# EAGLE design filters (EAGLE 6.5.0)
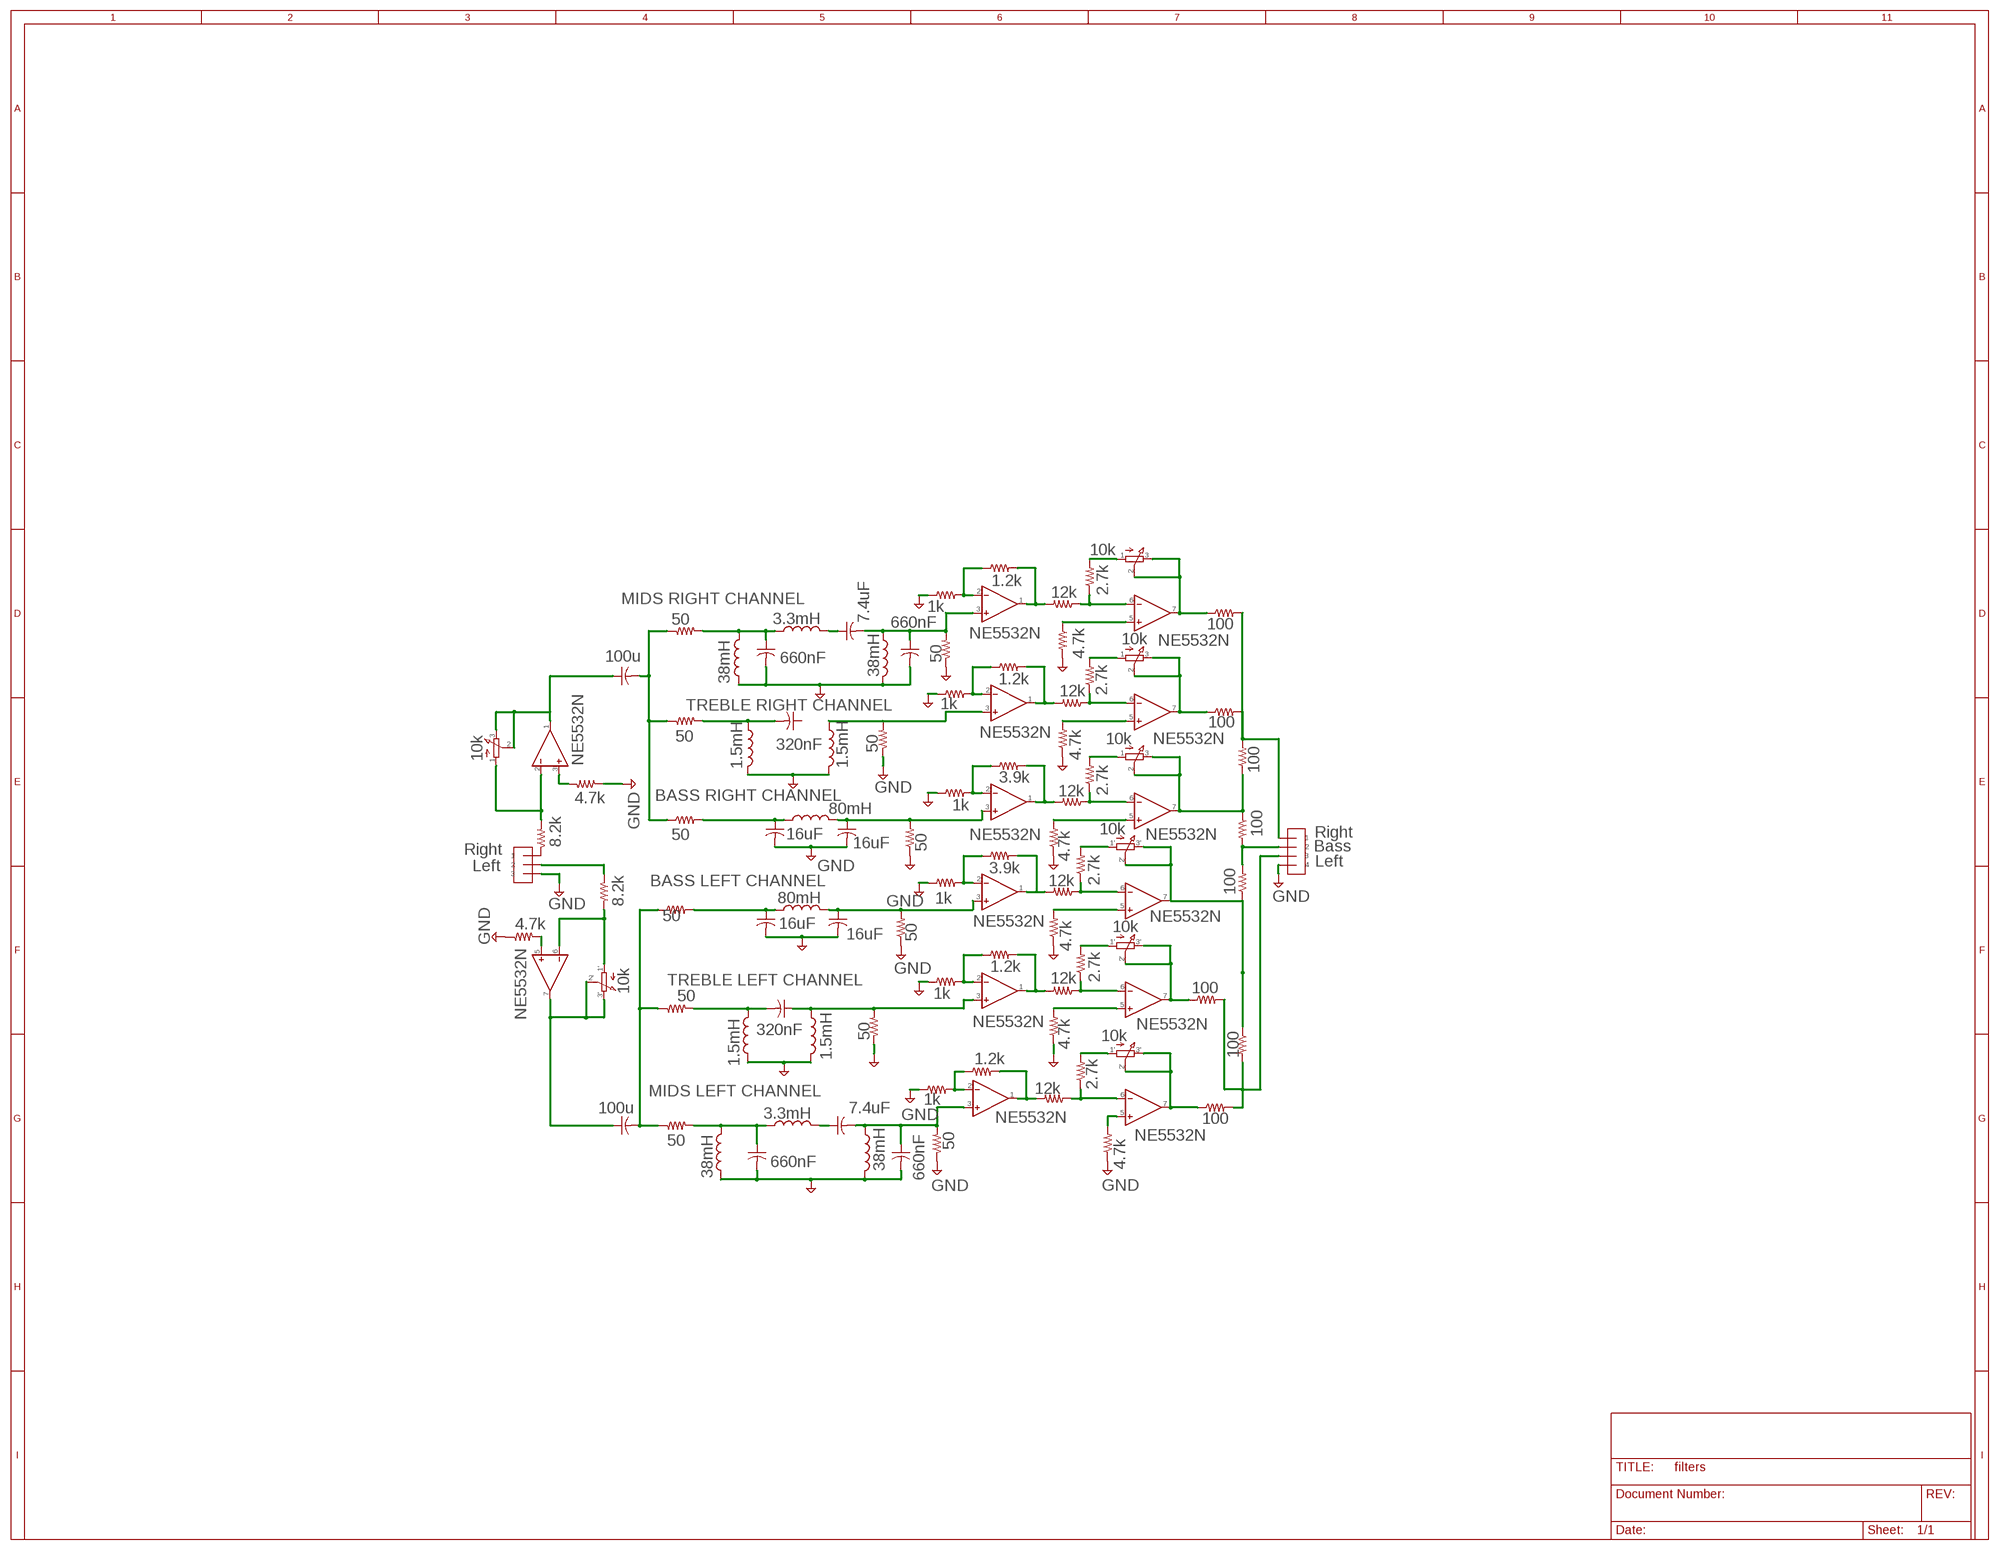
[diagram p0: schematic, sheet 1]

## Parts
C1  7.4uF  C-US050-024X044  [C050-024X044]
C2  660nF  C-US050-024X044  [C050-024X044]
C3  660nF  C-US050-024X044  [C050-024X044]
C4  320nF  C-US050-024X044  [C050-024X044]
C5  16uF  C-US050-024X044  [C050-024X044]
C6  16uF  C-US050-024X044  [C050-024X044]
C7  16uF  C-US050-024X044  [C050-024X044]
C8  16uF  C-US050-024X044  [C050-024X044]
C9  320nF  C-US050-024X044  [C050-024X044]
C10  7.4uF  C-US050-024X044  [C050-024X044]
C11  660nF  C-US050-024X044  [C050-024X044]
C12  660nF  C-US050-024X044  [C050-024X044]
C13  100u  C-US050-024X044  [C050-024X044]
C14  100u  C-US050-024X044  [C050-024X044]
IC1  NE5532N  [DIL08]
IC2  NE5532N  [DIL08]
IC3  NE5532N  [DIL08]
IC4  NE5532N  [DIL08]
IC5  NE5532N  [DIL08]
IC6  NE5532N  [DIL08]
IC7  NE5532N  [DIL08]
J1  3_PIN_AMPCONN  [3_PIN_AMPCONN]
J2  4_PIN_AMPCONN  [4_PIN_AMPCON]
L1  3.3mH  L-US6000-XXX-RC  [6000-XXXX-RC]
L2  38mH  L-US6000-XXX-RC  [6000-XXXX-RC]
L3  38mH  L-US6000-XXX-RC  [6000-XXXX-RC]
L4  1.5mH  L-US6000-XXX-RC  [6000-XXXX-RC]
L5  1.5mH  L-US6000-XXX-RC  [6000-XXXX-RC]
L6  80mH  L-US6000-XXX-RC  [6000-XXXX-RC]
L7  80mH  L-US6000-XXX-RC  [6000-XXXX-RC]
L8  1.5mH  L-US6000-XXX-RC  [6000-XXXX-RC]
L9  1.5mH  L-US6000-XXX-RC  [6000-XXXX-RC]
L10  3.3mH  L-US6000-XXX-RC  [6000-XXXX-RC]
L11  38mH  L-US6000-XXX-RC  [6000-XXXX-RC]
L12  38mH  L-US6000-XXX-RC  [6000-XXXX-RC]
R1  8.2k  R-US_0204/2V  [0204V]
R2  8.2k  R-US_0204/2V  [0204V]
R3  50  R-US_0204/2V  [0204V]
R4  50  R-US_0204/2V  [0204V]
R5  1k  R-US_0204/2V  [0204V]
R6  12k  R-US_0204/2V  [0204V]
R7  1k  R-US_0204/2V  [0204V]
R8  3.9k  R-US_0204/2V  [0204V]
R9  50  R-US_0204/2V  [0204V]
R10  50  R-US_0204/2V  [0204V]
R11  12k  R-US_0204/2V  [0204V]
R12  1.2k  R-US_0204/2V  [0204V]
R13  1k  R-US_0204/2V  [0204V]
R14  50  R-US_0204/2V  [0204V]
R15  50  R-US_0204/2V  [0204V]
R16  12k  R-US_0204/2V  [0204V]
R17  1.2k  R-US_0204/2V  [0204V]
R18  2.7k  R-US_0204/2V  [0204V]
R19  12k  R-US_0204/2V  [0204V]
R20  1k  R-US_0204/2V  [0204V]
R21  3.9k  R-US_0204/2V  [0204V]
R22  50  R-US_0204/2V  [0204V]
R23  50  R-US_0204/2V  [0204V]
R24  12k  R-US_0204/2V  [0204V]
R25  1.2k  R-US_0204/2V  [0204V]
R26  1k  R-US_0204/2V  [0204V]
R27  50  R-US_0204/2V  [0204V]
R28  50  R-US_0204/2V  [0204V]
R29  2.7k  R-US_0204/2V  [0204V]
R30  2.7k  R-US_0204/2V  [0204V]
R31  50  R-US_0204/2V  [0204V]
R32  50  R-US_0204/2V  [0204V]
R33  12k  R-US_0204/2V  [0204V]
R34  2.7k  R-US_0204/2V  [0204V]
R35  2.7k  R-US_0204/2V  [0204V]
R36  1.2k  R-US_0204/2V  [0204V]
R37  2.7k  R-US_0204/2V  [0204V]
R38  1k  R-US_0204/2V  [0204V]
R39  100  R-US_0204/2V  [0204V]
R40  100  R-US_0204/2V  [0204V]
R41  100  R-US_0204/2V  [0204V]
R42  4.7k  R-US_0204/2V  [0204V]
R43  4.7k  R-US_0204/2V  [0204V]
R44  4.7k  R-US_0204/2V  [0204V]
R45  4.7k  R-US_0204/2V  [0204V]
R46  4.7k  R-US_0204/2V  [0204V]
R47  4.7k  R-US_0204/2V  [0204V]
R48  4.7k  R-US_0204/2V  [0204V]
R49  4.7k  R-US_0204/2V  [0204V]
R88  100  R-US_0204/2V  [0204V]
R89  100  R-US_0204/2V  [0204V]
R90  100  R-US_0204/2V  [0204V]
R91  100  R-US_0204/2V  [0204V]
R92  100  R-US_0204/2V  [0204V]
VR1  10k  VOL_POT_2GANG  [VOL_POT_2GANG]
VR2  10k  P140KV1-F25BR  [TONE_POT_2GANG]
VR3  10k  P140KV1-F25BR  [TONE_POT_2GANG]
VR4  10k  P140KV1-F25BR  [TONE_POT_2GANG]

## Nets
BASS: J2.2 R41.2 R90.2
GND: C2.2 C3.2 C5.2 C6.2 C7.2 C8.2 C11.2 C12.2 J1.3 J2.4 L2.1 L3.2 L4.2 L5.2 L8.1 L9.2 L11.2 L12.1 R3.1 R5.1 R7.1 R10.1 R13.1 R15.1 R20.1 R23.1 R26.1 R28.1 R31.1 R38.1 R42.1 R43.1 R44.2 R45.1 R46.1 R47.1 R48.1 R49.1
LEFT: J2.3 R39.2 R91.2 R92.2
LEFT_IN: J1.2 R2.1
MVO: IC6.7(B:OUT) R40.1 R90.1 VR4.2(A:1_2) VR4.3(A:1_3)
N$1: IC1.2(A:-IN) R1.2 VR1.1
N$2: C13.1 IC1.1(A:OUT) VR1.2 VR1.3
N$3: IC1.6(B:-IN) R2.2 VR1.1'
N$4: IC2.6(B:-IN) R16.1 R18.1
N$5: C14.1 IC1.7(B:OUT) VR1.2' VR1.3'
N$6: IC6.2(A:-IN) R7.2 R8.1
N$7: C6.1 IC6.3(A:+IN) L6.2 R3.2
N$8: IC3.6(B:-IN) R33.1 R37.1
N$9: IC4.2(A:-IN) R12.1 R13.2
N$10: IC7.1(A:OUT) R19.2
N$11: IC6.6(B:-IN) R6.1 R34.1
N$12: C5.1 L6.1 R4.2
N$13: C4.2 L5.1 R9.2
N$14: C8.1 IC7.3(A:+IN) L7.2 R31.2
N$15: IC2.1(A:OUT) R16.2 R17.2
N$16: IC1.3(A:+IN) R42.2
N$17: IC4.1(A:OUT) R11.2 R12.2
N$18: IC4.6(B:-IN) R11.1 R35.1
N$20: IC1.5(B:+IN) R43.2
N$21: IC2.7(B:OUT) R88.1 VR2.2(A:1_2) VR2.3(A:1_3)
N$22: C13.2 R4.1 R9.1 R14.1
N$23: C2.1 L1.1 L2.2 R14.2
N$24: R18.2 VR2.1(A:1_1)
N$25: IC7.6(B:-IN) R19.1 R29.1
N$27: IC2.2(A:-IN) R5.2 R17.1
N$28: IC2.5(B:+IN) R44.1
N$29: C1.1 L1.2
N$30: C9.2 L8.2 R22.2
N$31: IC5.5(B:+IN) R48.2
N$32: IC5.1(A:OUT) R24.2 R25.2
N$33: IC5.6(B:-IN) R24.1 R30.1
N$34: C11.1 L10.1 L12.2 R27.2
N$35: C10.1 L10.2
N$36: IC4.5(B:+IN) R45.2
N$37: R29.2 VR4.1'(B:1_1)
N$39: IC6.5(B:+IN) R46.2
N$40: IC7.7(B:OUT) R39.1 R41.1 VR4.2'(B:1_2) VR4.3'(B:1_3)
N$41: IC5.7(B:OUT) R91.1 VR3.2'(B:1_2) VR3.3'(B:1_3)
N$42: R30.2 VR3.1'(B:1_1)
N$43: R21.2
N$44: C7.1 L7.1 R32.2
N$45: IC7.2(A:-IN) R20.2 R21.1
N$46: IC5.2(A:-IN) R25.1 R26.2
N$47: IC3.1(A:OUT) R33.2 R36.2
N$48: IC3.5(B:+IN) R49.2
N$49: IC7.5(B:+IN) R47.2
N$50: IC3.7(B:OUT) R92.1 VR2.2'(B:1_2) VR2.3'(B:1_3)
N$53: R34.2 VR4.1(A:1_1)
N$55: IC4.7(B:OUT) R89.1 VR3.2(A:1_2) VR3.3(A:1_3)
N$56: R35.2 VR3.1(A:1_1)
N$57: R37.2 VR2.1'(B:1_1)
N$58: IC3.2(A:-IN) R36.1 R38.2
N$59: C10.2 C12.1 IC3.3(A:+IN) L11.1 R28.2
N$60: C14.2 R22.1 R27.1 R32.1
N$61: C9.1 IC5.3(A:+IN) L9.1 R23.2
N$63: IC4.3(A:+IN) L4.1 R10.2
N$88: IC6.1(A:OUT) R6.2 R8.2
N$104: C1.2 C3.1 IC2.3(A:+IN) L3.1 R15.2
RIGHT: J2.1 R40.2 R88.2 R89.2
RIGHT_IN: J1.1 R1.1
Unconnected: C4.1 VR2.P$3(TAB) VR2.P$4(TAB) VR3.P$3(TAB) VR3.P$4(TAB) VR4.P$3(TAB) VR4.P$4(TAB)

## Notes on the sheet
- MIDS RIGHT CHANNEL
- TREBLE RIGHT CHANNEL
- BASS RIGHT CHANNEL
- Right
- Right | Bass
- Left | Left
- BASS LEFT CHANNEL
- TREBLE LEFT CHANNEL
- MIDS LEFT CHANNEL

## Power pins joined to a net without a drawn wire
V+: IC1.8(P:V+) IC2.8(P:V+) IC3.8(P:V+) IC4.8(P:V+) IC5.8(P:V+) IC6.8(P:V+) IC7.8(P:V+)
V-: IC1.4(P:V-) IC2.4(P:V-) IC3.4(P:V-) IC4.4(P:V-) IC5.4(P:V-) IC6.4(P:V-) IC7.4(P:V-)

## Library data of the parts
C1-C14 = rcl:C-US: CAPACITOR, American symbol
IC1-IC7 = linear:NE5532: AUDIO AMPLIFIER
J1 = Amplifier_Parts:3_PIN_AMPCONN
J2 = Amplifier_Parts:4_PIN_AMPCONN
L1-L12 = rcl:L-US: INDUCTOR, American symbol
R1-R49 R88-R92 = rcl:R-US_: RESISTOR, American symbol
VR1 = Amplifier_Parts:VOL_POT_2GANG
VR2-VR4 = Amplifier_Parts:P140KV1-F25BR

## Board
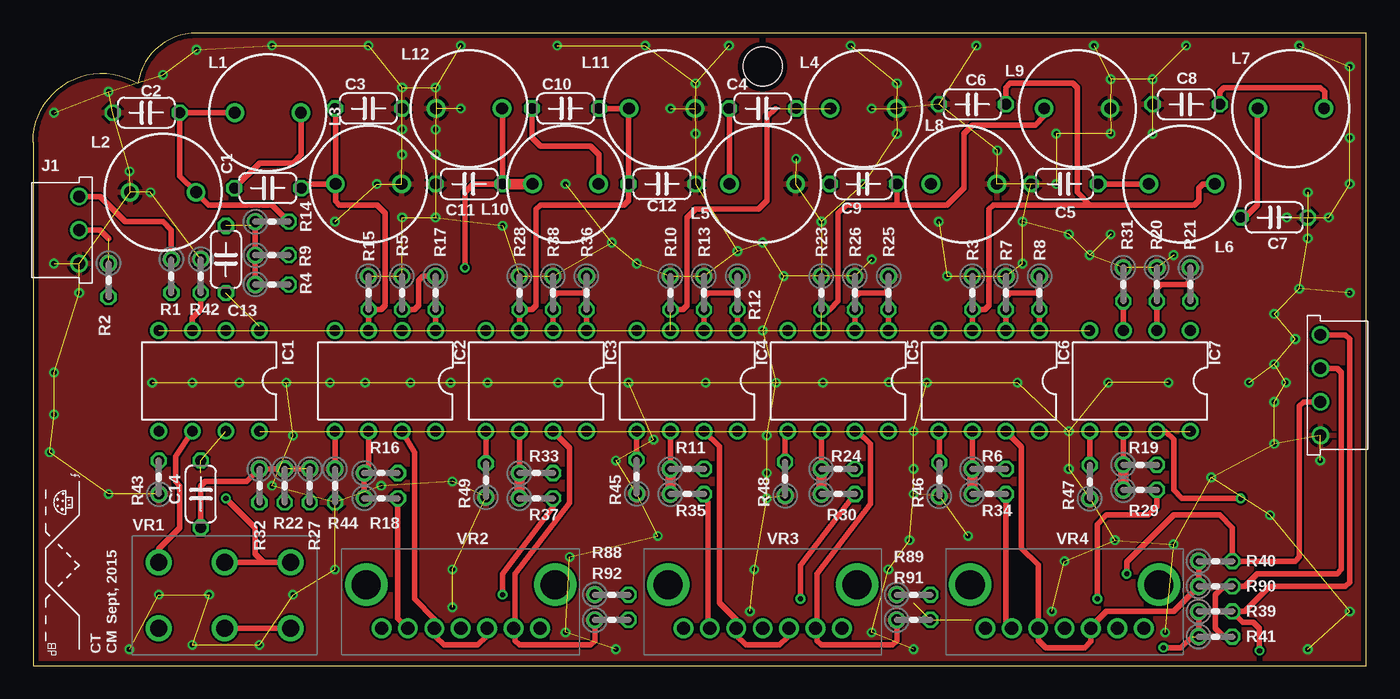
[diagram p1: board, top side]
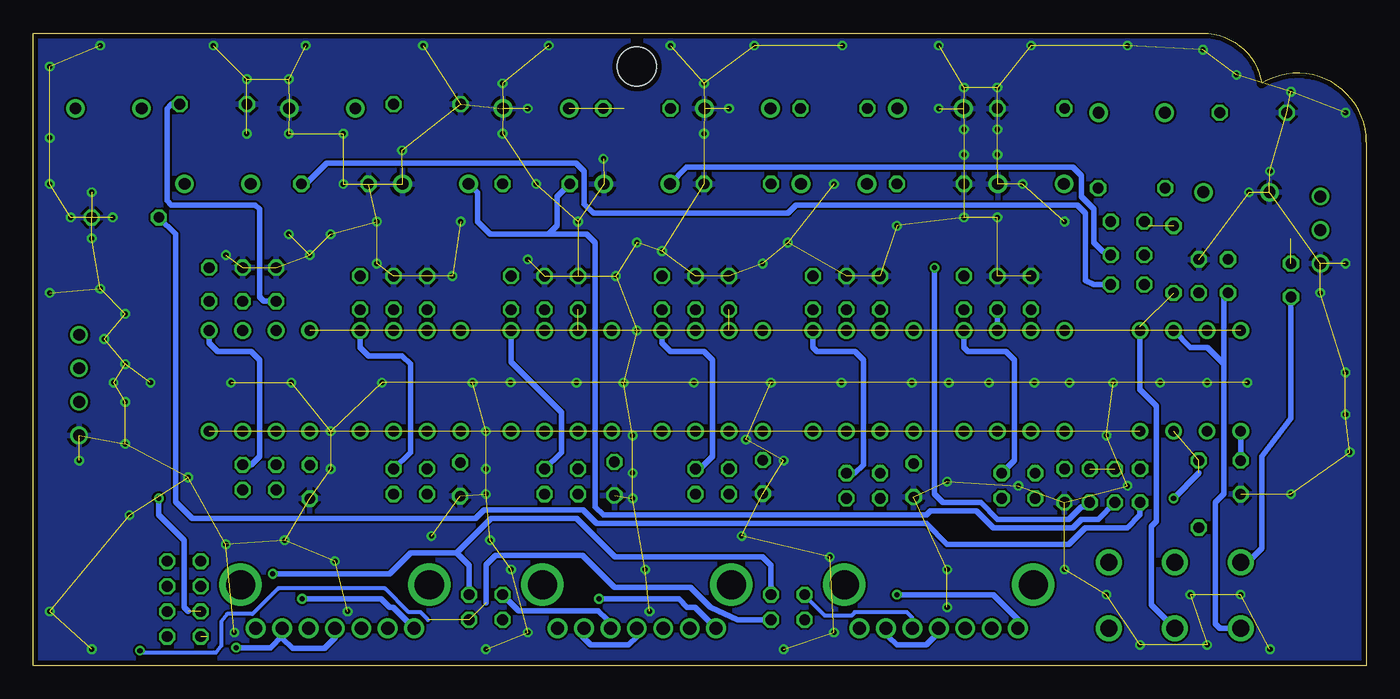
[diagram p2: board, bottom side, seen from below]

Size 100.97 x 47.94 mm. Coordinates in mm from the lower left corner, seen from the top.
Outline: 0,0 100.97,0 100.97,47.94 12.38,47.94 arc81 7.94,44.13 arc122 0,39.69 0,0
Copper layers (1*16): Top 0.0356mm / dielectric 1.5011mm / Bottom 0.0356mm
Design rules "OSH Park": minimum track width 6mil, minimum drill 13mil, track to track 6mil, track to pad 6mil, pad to pad 6mil, via to via 6mil, smd to smd 6mil, copper to edge 15mil, drill to drill 6mil, minimum pad ring 7mil, minimum via ring 7mil, stop-mask expansion 3mil, vias tented up to drill 0mil, thermal gap 10mil
Holes 2.95 mm at 55.24,45.4

### Footprints (pad centres in the part's own frame; a part is rotated, then mirrored left to right if it is on the bottom)
C050-024X044 = drill 0.813 octagon: 1 -2.54,0; 2 2.54,0
DIL08 = drill 0.813 pad 1.27: 1 -3.81,-3.81; 2 -1.27,-3.81; 3 1.27,-3.81; 4 3.81,-3.81; 5 3.81,3.81; 6 1.27,3.81; 7 -1.27,3.81; 8 -3.81,3.81
3_PIN_AMPCONN = drill 0.89: 1 2.54,0; 2 0,0; 3 -2.54,0
4_PIN_AMPCON = drill 0.89: 1 1.27,0; 2 -1.27,0; 3 -3.81,0; 4 3.81,0
6000-XXXX-RC = drill 0.9 pad 1.422: 1 -2.5,0; 2 2.5,0
0204V = drill 0.813 octagon: 1 -1.27,0; 2 1.27,0
VOL_POT_2GANG = drill 1.3: 1 -5,-2; 1' -5,3; 2 0,-2; 2' 0,3; 3 5,-2; 3' 5,3
TONE_POT_2GANG = drill 1: 1 -4,0; 1' -6,0; 2 -2,0; 2' 0,0; 3 2,0; 3' 4,0; NC 6,0 | drill 2.2 pad 2.413: P$3 -7.15,3.3; P$4 7.15,3.3

### Placement (x,y rotation side)
C1  17.78,36.2 0 top
C2  8.57,41.91 180 top
C3  25.4,42.23 0 top
C4  55.24,42.23 180 top
C5  78.11,36.51 180 top
C6  71.12,42.55 180 top
C7  93.98,33.97 0 top
C8  87.31,42.55 180 top
C9  62.87,36.51 180 top
C10  40.32,42.23 0 top
C11  33.02,36.51 180 top
C12  47.62,36.51 0 top
C13  14.61,30.8 90 top
C14  12.7,13.02 270 top
IC1  13.34,21.59 180 top
IC2  26.67,21.59 180 top
IC3  38.1,21.59 180 top
IC4  49.53,21.59 180 top
IC5  60.96,21.59 180 top
IC6  72.39,21.59 180 top
IC7  83.82,21.59 180 top
J1  3.49,33.02 90 top
J2  97.47,21.27 270 top
L1  17.78,41.91 0 top
L2  9.84,35.88 0 top
L3  25.4,36.51 0 top
L4  62.87,42.23 0 top
L5  55.24,36.51 0 top
L6  87,36.51 0 top
L7  95.25,42.23 0 top
L8  70.48,36.51 180 top
L9  79.06,42.23 0 top
L10  40.32,36.51 0 top
L11  47.62,42.23 0 top
L12  33.02,42.23 0 top
R1  10.48,29.53 270 top
R2  5.71,29.21 270 top
R3  71.12,28.26 270 top
R4  18.1,28.89 0 top
R5  27.94,28.26 270 top
R6  72.39,14.92 0 top
R7  73.66,28.26 270 top
R8  76.2,28.26 270 top
R9  18.1,31.11 0 top
R10  48.26,28.26 270 top
R11  49.53,14.92 0 top
R12  53.34,28.26 270 top
R13  50.8,28.26 270 top
R14  18.1,33.66 0 top
R15  25.4,28.26 270 top
R16  26.35,14.61 0 top
R17  30.48,28.26 270 top
R18  26.35,12.7 0 top
R19  83.82,15.24 0 top
R20  85.09,28.89 270 top
R21  87.63,28.89 270 top
R22  19.05,13.65 270 top
R23  59.69,28.26 270 top
R24  60.96,14.92 0 top
R25  64.77,28.26 270 top
R26  62.23,28.26 270 top
R27  20.95,13.65 270 top
R28  36.83,28.26 270 top
R29  83.82,13.34 0 top
R30  60.96,13.02 0 top
R31  82.55,28.89 270 top
R32  17.14,13.65 270 top
R33  38.1,14.61 0 top
R34  72.39,13.02 0 top
R35  49.53,13.02 0 top
R36  41.91,28.26 270 top
R37  38.1,12.7 0 top
R38  39.37,28.26 270 top
R39  89.53,4.13 0 top
R40  89.53,7.94 0 top
R41  89.53,2.22 0 top
R42  12.7,29.53 270 top
R43  9.53,14.29 90 top
R44  22.86,13.65 270 top
R45  45.71,14.33 90 top
R46  68.62,14.14 90 top
R47  80.01,13.94 90 top
R48  56.95,14.19 90 top
R49  34.29,14.06 90 top
R88  43.81,5.4 0 top
R89  66.67,5.4 0 top
R90  89.53,6.03 0 top
R91  66.67,3.49 0 top
R92  43.81,3.49 0 top
U$1  [MUSHROOM]  2.22,12.38 90 top
U$2  [BODE]  3.49,7.62 90 top
VR1  14.51,4.85 0 top
VR2  32.38,2.86 0 top
VR3  55.24,2.86 0 top
VR4  78.11,2.86 0 top

### Tracks (layer width: path | path; a pad name or v marks a point on that pad's centre or on a via)
BASS
  Top 0.406: R41.2 90.17,2.22 89.53,2.86 89.53,5.4 90.17,6.03 R90.2 91.76,6.03 92.71,6.99 98.74,6.99 99.06,7.3 99.06,22.23 98.74,22.54 J2.2
GND  (via drill 0.38)  (183 unrouted)
  other vias: 9.02,21.46 12.06,21.46 15.62,21.46 19.18,21.46 22.48,21.46 25.15,21.46 28.57,21.46 31.62,21.46 34.42,21.46 39.75,21.46 45.09,21.46 50.93,21.46 56.26,21.46 59.82,21.46 64.81,21.48 67.69,21.46 74.55,21.46 81.41,21.46 85.98,21.46 92.08,21.46 94.87,21.46 93.98,26.67 93.98,22.86 95.57,24.77 93.98,20 97.47,15.56 93.98,16.83 89.22,14.29 86.36,9.21 78.42,17.78 78.42,14.92 70.8,9.84 66.67,13.02 66.67,14.92 66.67,17.78 55.56,17.46 55.56,14.61 55.56,12.7 46.99,17.14 77.15,4.13 54.29,4.13 40.32,2.54 31.75,4.45 31.75,7.3 19.68,5.4 26.35,13.65 47.31,9.84 44.13,15.56 31.75,13.97 19.68,17.46 18.1,13.65 9.53,5.4 1.27,16.19 7.3,1.27 12.06,1.59 17.14,1.59 22.86,7.3 44.13,1.27 66.67,1.27 63.5,2.54 54.61,7.3 40.64,8.26 96.52,1.27 99.69,4.13 93.66,11.43 95.89,28.57 98.11,33.97 99.69,36.51 99.69,40.01 96.52,35.88 99.69,28.26 96.52,32.38 94.93,33.97 81.6,44.45 77.47,40.32 81.6,40.32 84.77,40.32 84.77,44.45 53.34,31.43 77.47,36.51 74.93,33.66 73.03,39.05 65.41,44.13 63.5,42.23 65.41,40.32 57.78,38.42 50.16,40.32 48.26,42.23 55.24,32.07 50.16,44.13 40.32,36.51 32.38,42.23 30.48,43.81 30.48,40.64 27.94,40.64 27.94,43.81 27.94,38.73 26.04,36.51 30.48,38.73 27.94,33.97 8.89,35.88 7.3,37.47 1.59,19.05 1.59,22.23 1.59,30.48 3.49,28.26 1.59,41.91 81.92,9.53 85.72,2.54 13.34,5.4 5.71,43.5 9.84,44.77 12.38,46.67 18.1,46.99 25.4,46.99 32.38,46.99 39.69,46.99 46.35,46.99 52.7,46.99 61.91,46.99 71.44,46.99 80.33,46.99 87.31,46.99 95.89,46.99 99.69,45.4 30.48,33.97 35.56,33.34 43.81,32.07 45.72,30.48 55.24,25.4 59.69,33.66 62.87,36.51 63.5,30.8 68.58,33.66 74.93,30.48 69.22,29.53 86.36,31.11 78.42,32.7 80.01,31.11 81.6,32.7 22.86,33.66 56.83,29.53 66.36,9.53 64.77,7.3 78.11,7.94 5.71,13.02
  pour Top: 0,0 100.97,0 100.97,47.94 0,47.94
  pour Bottom: 0,0 100.97,-0.32 100.97,47.94 0,47.94
LEFT  (via drill 0.38)  (2 unrouted)
  Top 0.406: v92.87,1.16 92.87,2.84 92.38,3.32 91.61,3.32 R39.2 91.76,4.13 93.66,6.03 99.38,6.03 99.69,6.35 99.69,24.77 99.38,25.08 J2.3
  Bottom 0.305: 71.06,3.49 71.63,4.06 72.52,4.06 74.32,5.87 82.4,5.87 84.34,3.94 86.27,3.94 86.71,3.38 86.71,1.56 87.12,1.02 92.72,1.02 v92.87,1.16
  Bottom 0.406: 66.65,4.79 66.65,7.67 65.94,8.38 59.36,8.38 56.95,5.97 51.18,5.97 49.66,4.45 47.62,3.49 R92.2
LEFT_IN  (1 unrouted)
  Top 0.406: J1.2 5.08,33.02 5.71,32.38
MVO
  Top 0.406: VR4.3 80.11,1.86 79.62,1.38 76.68,1.38 76.11,1.95 VR4.2 76.11,7.65 74.85,8.91 74.85,16.59 IC6.7 | VR4.3 | VR4.3 80.11,2.96 81.28,4.13 86.36,4.13 R90.1 R40.1
N$1
  Bottom 0.406: VR1.1 11.1,2.85 11.43,3.17 11.43,12.38 10.79,13.02 10.79,22.86 | 10.79,22.86 12.06,24.13 13.34,24.13 IC1.2 | R1.2 10.79,27.94 10.79,22.86
N$2  (1 unrouted)
  Top 0.406: VR1.2 VR1.3 | 17.14,25.72 IC1.1
  Bottom 0.406: VR1.2 16.29,4.62 16.29,10.57 15.89,10.96 15.89,19.7 17.14,20.95 17.14,21.46 | 17.14,21.46 | IC1.1 17.14,21.46
N$3
  Top 0.406: IC1.6 10.79,15.88 10.79,13.97 11.11,13.65 11.11,10.48 9.51,8.88 VR1.1' 9.75,7.85
  Bottom 0.406: R2.2 5.71,18.73 7.94,15.88 7.94,8.89 8.98,7.85 VR1.1' 9.53,7.86
N$4
  Top 0.406: R18.1 R16.1 25.4,14.92 IC2.6
N$5  (via drill 0.38)  (2 unrouted)
  Top 0.406: VR1.2' 17.46,7.85 | 17.46,7.85 VR1.3' | v14.61,12.7 16.83,10.48 16.83,8.48 17.46,7.85
  Bottom 0.406: 14.51,8.37 VR1.2' | 12.7,14.61 v14.61,12.7
N$6
  Top 0.406: IC6.2 R7.2 73.66,27.94 73.98,28.26 75.88,28.26 76.2,28.57 R8.1
N$7
  Top 0.406: 80.01,34.92 87.95,34.92 88.27,35.24 88.27,36.2 88.58,36.51 L6.2 | 80.01,34.92 72.71,34.92 72.39,34.61 72.39,27.3 72.07,26.99 R3.2 IC6.3 | C6.1 73.66,43.81 73.98,44.13 78.74,44.13 79.06,43.81 79.06,35.88 80.01,34.92
N$8
  Top 0.406: IC3.6 R37.1
  Top 0.813: R33.1 R37.1
N$9
  Top 0.406: IC4.2 R13.2 50.8,27.94 51.12,28.26 53.02,28.26 53.34,28.57 R12.1
N$10
  Bottom 0.406: R19.2 84.45,15.24 83.82,15.88 83.82,23.18 84.45,23.81 87,23.81 87.63,24.45 IC7.1
N$11
  Top 0.406: IC6.6 R6.1
  Top 0.813: R6.1 R34.1
N$12
  Top 0.406: C5.1 L6.1
  Bottom 0.406: R4.2 20.64,28.89 21.27,29.21 21.27,34.29 21.91,34.92 43.18,34.92 43.81,34.29 58.52,34.29 59.23,35 59.23,37.47 59.87,38.1 78.74,38.1 80.33,36.51 C5.1
N$13
  Top 0.406: C4.2 52.74,41 L5.1
  Bottom 0.406: L5.1 51.48,37.78 22.23,37.78 21.59,37.15 21.59,35.56 20.64,34.61 20.64,32.07 20,31.43 R9.2
N$14
  Top 0.406: R31.2 IC7.3 | L7.2 97.79,42.27 97.79,43.5 97.47,43.81 90.17,43.81 89.85,43.5 C8.1
  Bottom 0.406: R31.2 83.5,27.62 83.82,27.94 83.82,34.61 84.14,34.92 90.49,34.92 90.81,35.24 90.81,42.23 90.49,42.55 C8.1
N$15
  Top 0.406: R17.2 IC2.1
  Bottom 0.406: R16.2 26.67,15.56 26.67,23.18 27.3,23.81 30.16,23.81 30.48,24.13 IC2.1
N$16
  Top 0.406: IC1.3 12.06,26.35 12.7,26.99 R42.2
N$17
  Top 0.406: R12.2 IC4.1
  Bottom 0.406: R11.2 50.48,14.92 49.53,15.88 49.53,23.18 50.16,23.81 52.7,23.81 53.34,24.45 IC4.1
N$18
  Top 0.406: R11.1 IC4.6
  Top 0.813: R11.1 R35.1
N$20
  Bottom 0.406: IC1.5 R43.2
N$21
  Top 0.406: VR2.3 34.29,2.76 34.29,2.22 33.66,1.59 31.11,1.59 30.48,2.22 30.48,2.95 VR2.2 30.39,3.59 28.89,5.08 28.89,16.19 IC2.7
  Bottom 0.305: VR2.3 34.38,3.65 34.8,4.06 38.73,4.06 38.99,3.81 41.02,3.81 42.55,5.33
  Bottom 0.406: 42.55,5.33 R88.1
N$22  (1 unrouted)
  Top 0.406: R4.1 R9.1 R14.1 16.51,33.34
N$23
  Top 0.406: L1.1 C2.1 11.11,37.11 L2.2 13.31,34.91 18.12,34.91 R14.2
N$24
  Top 0.406: R18.2 27.62,3.62 VR2.1
N$25
  Top 0.406: IC7.6 R19.1
  Top 0.813: R19.1 R29.1
N$27
  Top 0.406: R5.2 28.89,26.99 29.21,27.3 29.21,29.21 29.53,29.53 R17.1
  Bottom 0.406: IC2.2 R5.2
N$28
  Top 0.406: R44.1 IC2.5
N$29
  Top 0.406: C1.1 17.14,38.1 19.68,38.1 20.32,38.73 20.32,41.87
  Top 0.813: 20.32,41.87 L1.2
N$30
  Bottom 0.406: R22.2 20.32,11.11 21.59,11.11 22.23,10.48 28.26,10.48 29.53,11.75 33.02,11.75 33.34,11.43 57.78,11.43 58.42,12.06 58.42,32.07 59.05,32.7 61.91,32.7 | L8.2 67.31,35.84 67.31,33.66 66.36,32.7 61.91,32.7 | C9.2 61.28,35.56 61.28,33.34 61.91,32.7
N$31
  Top 0.406: IC5.5 56.95,17.58 R48.2
N$32
  Top 0.406: IC5.1 R25.2
  Bottom 0.406: R24.2 60.96,16.19 60.96,19.21 64.77,23.02 IC5.1
N$33
  Top 0.406: IC5.6 R24.1
  Top 0.813: R24.1 R30.1
N$34  (via drill 0.38)
  Top 0.406: v32.7,30.16 32.7,35.88 33.34,36.51 C11.1 35.56,42.19 L12.2
  Top 0.813: C11.1 L10.1
  Bottom 0.406: R27.2 21.27,12.06 21.59,12.06 22.54,11.11 27.94,11.11 29.21,12.38 32.07,12.38 32.7,13.02 v32.7,30.16
N$35
  Top 0.406: L10.2 42.86,36.55 42.86,38.73 42.23,39.37 38.42,39.37 37.78,40.01 C10.1
N$36
  Top 0.406: IC4.5 45.71,17.77 R45.2
N$37  (via drill 0.38)
  Top 0.406: v80.58,5.08 80.58,10.73 81.28,11.43 84.45,11.43 85.09,12.06 R29.2
  Bottom 0.406: v80.58,5.08 74.61,5.08 73.98,4.45 73.69,4.45 VR4.1'
N$39
  Top 0.406: IC6.5 68.62,17.74 R46.2
N$40  (via drill 0.38)  (2 unrouted)
  Top 0.406: 87.77,2.22 86.92,1.38 85.59,1.38 v85.58,1.39 | IC7.7 85.72,17.78 86.36,17.14 86.36,13.34 87,12.7 v91.44,12.7 | R39.1 R41.1
  Bottom 0.406: VR4.2' 78.11,2.12 78.9,1.33 81.31,1.33 82.08,2.1 82.08,2.28 | 82.08,2.28 82.08,2.84 VR4.3' | v85.58,1.39 82.97,1.39 82.08,2.28 | v91.44,12.7 91.44,11.43 89.53,9.53 89.53,4.45 89.22,4.13
N$41
  Top 0.406: 59.37,2.98 59.37,6.99 63.39,12.27 63.39,16.8 62.41,17.78 IC5.7 | 59.37,2.98 VR3.3' | 59.37,2.98 59.37,1.91 59.69,1.59 65.09,1.59 65.41,1.91 R91.1
  Bottom 0.406: VR3.2' 55.24,2.22 55.88,1.59 58.74,1.59 59.37,2.22 59.37,2.73 VR3.3'
N$42  (via drill 0.38)
  Top 0.406: v58.1,5.08 58.1,7.62 R30.2
  Bottom 0.406: v58.1,5.08 52.07,5.08 51.44,4.45 50.83,4.45 VR3.1'
N$44
  Top 0.406: L7.1 92.71,42.19 92.71,34.92 91.76,33.97 C7.1
  Bottom 0.406: R32.2 17.14,11.43 18.1,10.48 21.27,10.48 22.54,9.21 31.75,9.21 33.34,10.79 58.29,10.79 59.31,11.81 66.8,11.81 67.44,11.18 88.9,11.18 90.17,12.45 90.17,32.7 C7.1
N$45
  Top 0.406: IC7.2 R20.2 85.09,28.57 85.41,28.89 87.31,28.89 87.63,29.21 R21.1
N$46
  Top 0.406: IC5.2 R26.2 62.23,27.94 62.55,28.26 64.45,28.26 64.77,28.57 R25.1
N$47
  Top 0.406: R36.2 IC3.1
  Bottom 0.406: R33.2 38.73,14.61 38.1,15.24 38.1,23.18 38.73,23.81 41.59,23.81 41.91,24.13 IC3.1
N$48
  Top 0.406: IC3.5 R49.2
N$49
  Top 0.406: IC7.5 R47.2
N$50
  Top 0.406: 36.51,2.98 36.51,6.99 40.62,12.37 40.62,16.53 IC3.7 | 36.51,2.98 VR2.3' | 36.51,2.98 36.51,1.91 36.83,1.59 42.23,1.59 42.55,1.91 R92.1
  Bottom 0.406: VR2.2' 32.38,2.54 33.34,1.59 35.56,1.59 36.2,2.22 36.2,2.67 VR2.3'
N$53
  Top 0.406: R34.2 73.66,3.3 VR4.1
N$55
  Top 0.406: VR3.3 57.15,2.76 57.15,2.22 56.52,1.59 53.98,1.59 53.24,2.32 VR3.2 53.24,3.52 51.97,4.8 51.97,16.61 IC4.7
  Bottom 0.406: VR3.3 57.47,3.08 57.47,3.49 58.17,4.19 61.34,4.19 64.2,4.19 R89.1
N$56
  Top 0.406: R35.2 50.48,13.02 51.12,12.38 51.12,2.98 VR3.1
N$57  (via drill 0.38)
  Top 0.406: v35.56,5.4 35.56,6.99 39.37,12.06 R37.2
  Bottom 0.406: v35.56,5.4 28.26,5.4 26.35,3.49 26.35,2.89 VR2.1'
N$58
  Top 0.406: IC3.2 R38.2 39.37,27.94 39.69,28.26 41.59,28.26 41.91,28.57 R36.1
N$59
  Top 0.406: C10.2 L11.1 45.09,42.19 C12.1 45.09,35.24 44.77,34.92 38.42,34.92 38.1,34.61 38.1,27.3 37.78,26.99 R28.2 IC3.3
N$60  (1 unrouted)
  Top 0.406: R27.1 R32.1 16.19,13.97 13.02,13.97 12.7,13.65 C14.2
N$61  (1 unrouted)
  Top 0.406: 65.41,34.92 69.22,34.92 70.48,36.2 70.48,40.32 71.12,40.96 75.88,40.96 76.52,41.59 76.52,42.19 L9.1 | C9.1 65.41,34.92 | R23.2 60.33,26.99 60.96,27.62 60.96,34.29 61.59,34.92 65.41,34.92
N$63  (2 unrouted)
  Top 0.406: 56.2,42.23 55.56,41.59 55.56,35.24 54.93,34.61 50.16,34.61 49.53,33.97 49.53,27.3 49.21,26.99 R10.2
N$88
  Top 0.406: R8.2 IC6.1
  Bottom 0.406: R6.2 72.39,16.19 72.39,22.86 73.03,23.5 75.56,23.5 76.2,24.13 IC6.1
N$104
  Top 0.406: L3.1 22.9,35.2 23.18,34.92 26.04,34.92 26.67,34.29 26.67,27.3 26.35,26.99 R15.2 IC2.3 | L3.1 22.9,42.19 C3.1 | C1.2 20.64,36.51 L3.1
RIGHT  (via drill 0.38)
  Top 0.406: v82.8,6.99 82.8,7.87 86.36,11.43 89.85,11.43 90.81,10.48 R40.2 95.57,7.94 95.89,8.26 95.89,19.68 96.2,20 J2.1
  Bottom 0.406: v82.8,6.99 73.98,6.99 72.39,8.57 68.9,8.57 | 68.9,8.57 67.94,7.62 R89.2 | 68.9,8.57 66.29,11.18 59.82,11.18 56.9,8.26 45.72,8.26 45.09,7.62 R88.2
RIGHT_IN
  Top 0.406: J1.1 5.08,35.56 6.99,33.66 9.84,33.66 10.48,33.02 R1.1
V+  (6 unrouted)
V-  (6 unrouted)

### Text on the board
tPlace: Sept, 2015 | CT / CM